# Altium schematic sheet pcf.SchDoc
size A4
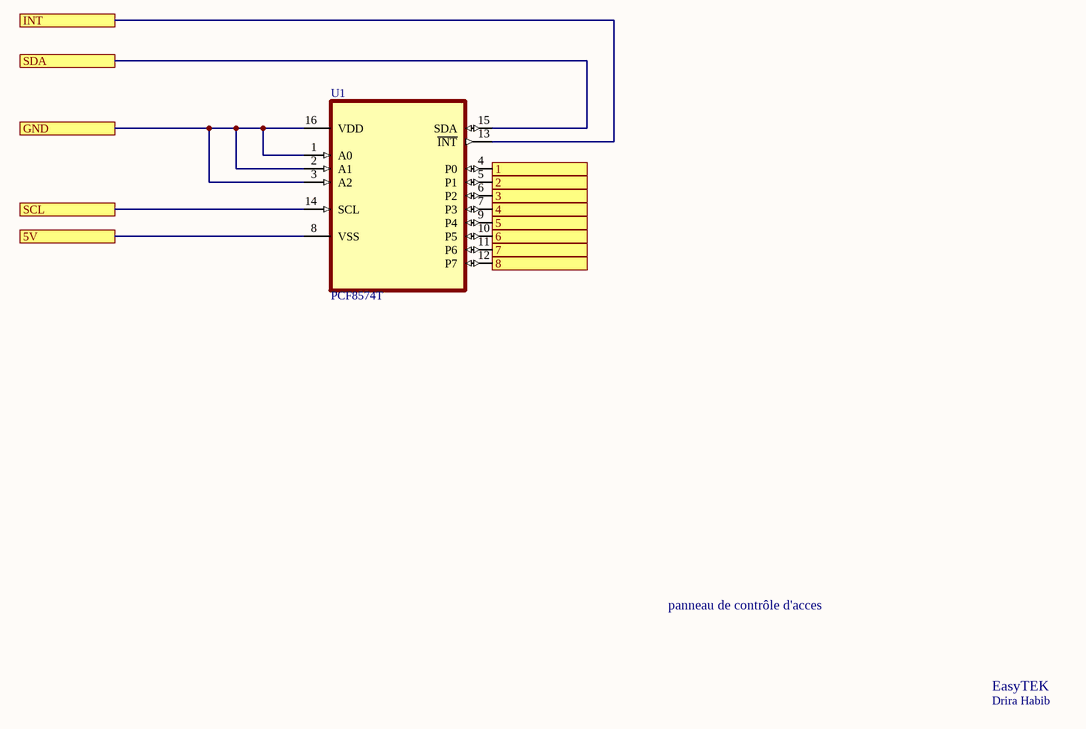
[diagram p0: pcf.SchDoc]

## Parts
U1  PCF8574T  [SOIC127P1032X265-16N]

## Ports
1, 2, 3, 4, 5, 5V, 6, 7, 8, GND, INT, SCL, SDA

## Nets
1: U1.4(P0) ; port 1
2: U1.5(P1) ; port 2
3: U1.6(P2) ; port 3
4: U1.7(P3) ; port 4
5: U1.9(P4) ; port 5
5V: U1.8(VSS) ; port 5V
6: U1.10(P5) ; port 6
7: U1.11(P6) ; port 7
8: U1.12(P7) ; port 8
GND: U1.1(A0) U1.2(A1) U1.3(A2) U1.16(VDD) ; port GND
INT: U1.13(~{INT}) ; port INT
SCL: U1.14(SCL) ; port SCL
SDA: U1.15(SDA) ; port SDA

## Notes on the sheet
- panneau de contrôle d'acces
- EasyTEK
- Drira Habib

## Library data of the parts
U1 = PCF8574T: I/O Expander 8 IÂ²C 100 kHz 20-SSOP; MF: NXP Semiconductors; MP: PCF8574T; Price: None; Availability: In Stock; Package: SOIC-16 NXP Semiconductors; Purchase-URL: https://pricing.snapeda.com/search/part/PCF8574T/?ref=eda; SnapEDA_Link: https://www.snapeda.com/parts/PCF8574T/NXP+Semiconductors/view-part/?ref=snap; Value: *; Check_prices: https://www.snapeda.com/parts/PCF8574T/NXP+Semiconductors/view-part/?ref=eda